# EAGLE schematic Circuit V1 (EAGLE 9.2.0)
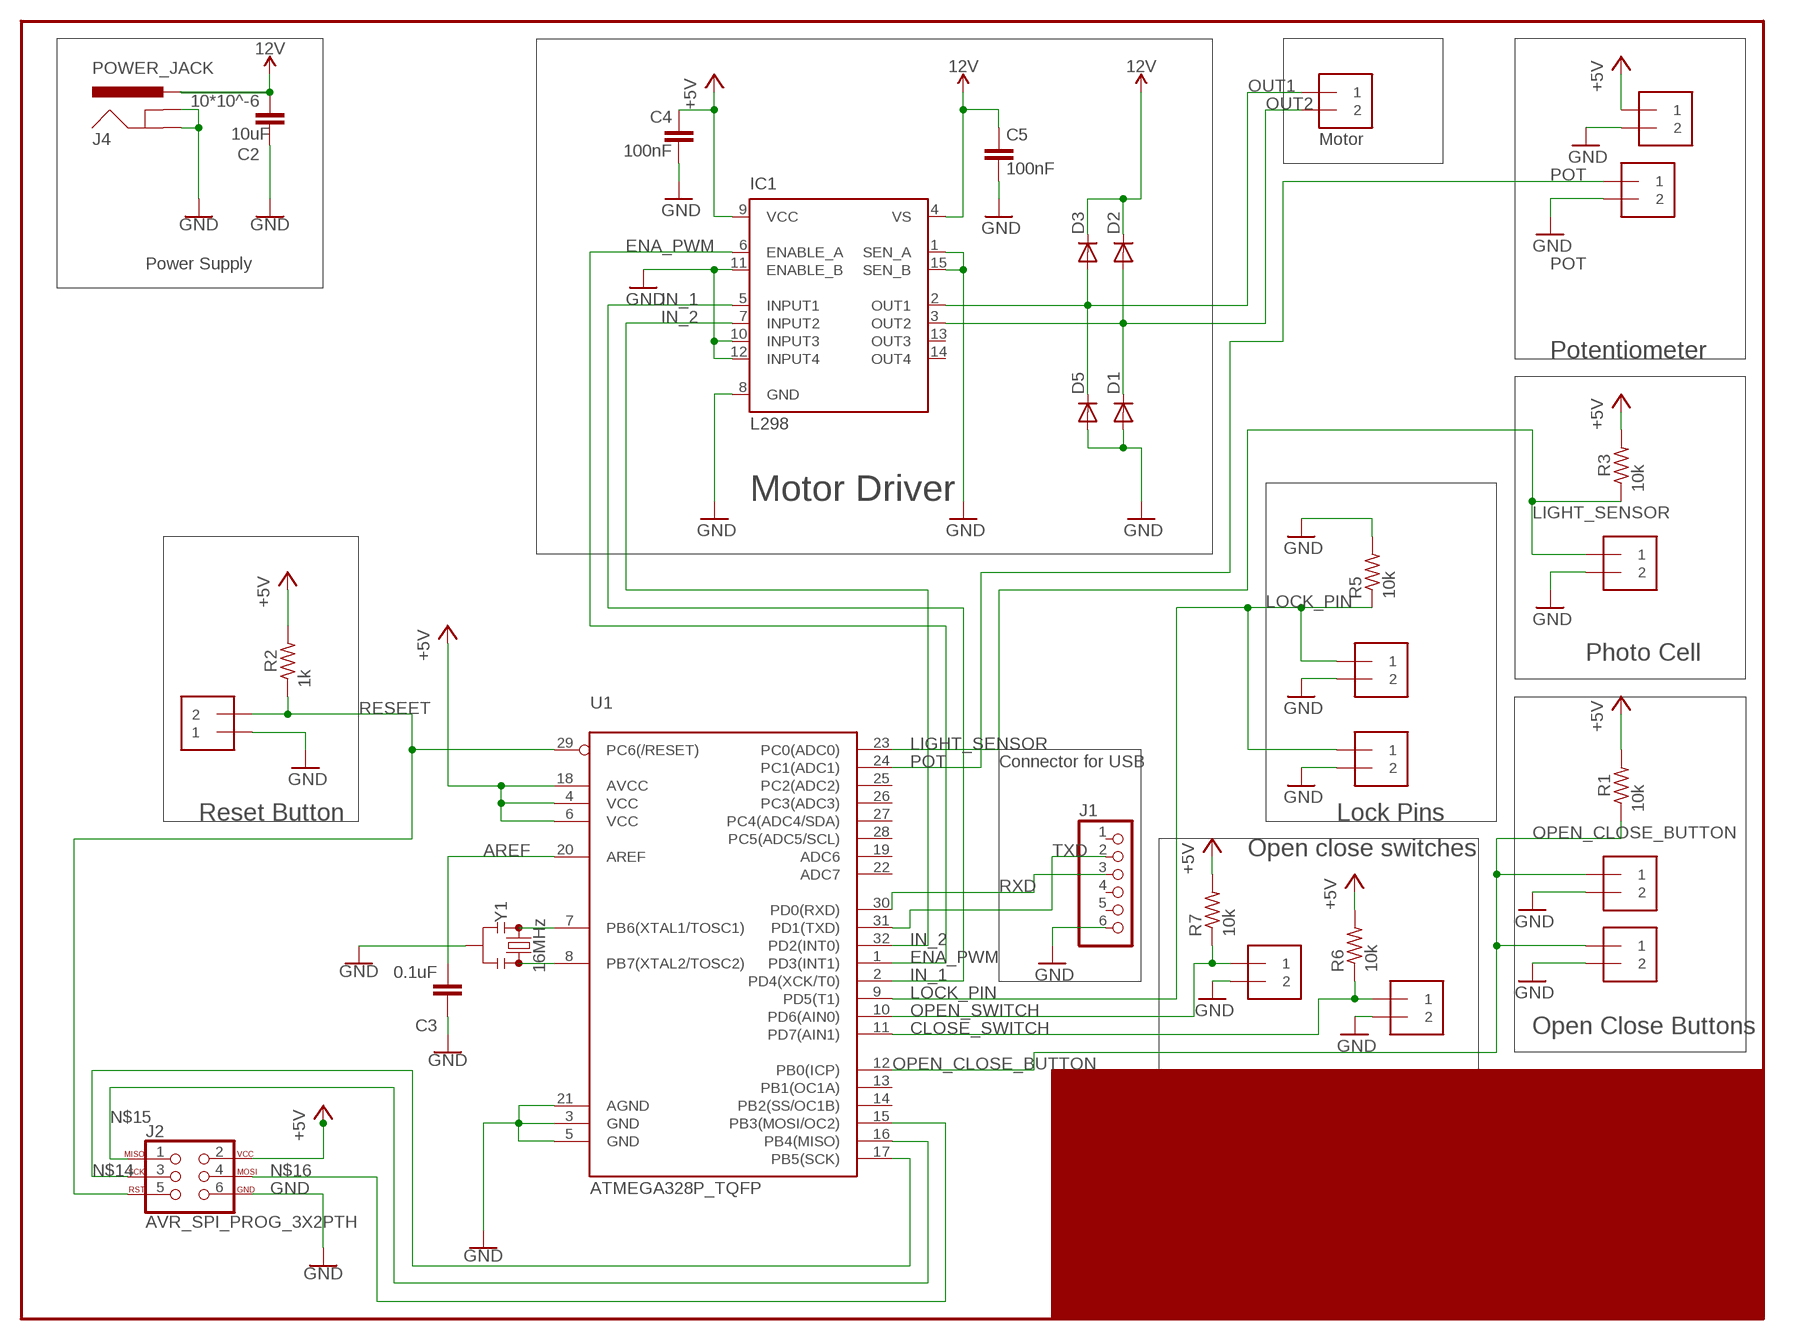
[diagram p0: schematic, sheet 1]

## Parts
C2  10*10^-6  C-EUC0805  [C0805]
C3  0.1uF  C-EUC0805  [C0805]
C4  100nF  C-EUC0805  [C0805]
C5  100nF  C-EUC0805  [C0805]
D1  DIODE-DO214AA  [DO214AA]
D2  DIODE-DO214AA  [DO214AA]
D3  DIODE-DO214AA  [DO214AA]
D5  DIODE-DO214AA  [DO214AA]
FRAME1  FRAME-LETTER  [CREATIVE_COMMONS]
IC1  L298  [MULTIWATT-15]
INSIDE_BUTTON  1X2-3.5MM  [1X2-3.5MM]
INSIDE_OPEN_BUTTON  1X2-3.5MM  [1X2-3.5MM]
J1  PINHD-1X6  [1X06]
J2  AVR_SPI_PROG_3X2PTH  [2X3]
J4  POWER_JACK  [POWER_JACK_PTH]
LIGHT_SENSOR  1X2-3.5MM  [1X2-3.5MM]
LOCK_PIN1  1X2-3.5MM  [1X2-3.5MM]
LOCK_PIN2  1X2-3.5MM  [1X2-3.5MM]
MOTOR  1X2-3.5MM  [1X2-3.5MM]
OUTSIDE_BUTTON  1X2-3.5MM  [1X2-3.5MM]
OUTSIDE_OPEN_BUTTON  1X2-3.5MM  [1X2-3.5MM]
POT  1X2-3.5MM  [1X2-3.5MM]
POTPOWER  1X2-3.5MM  [1X2-3.5MM]
R1  10k  R-US_M0805  [M0805]
R2  1k  R-US_M0805  [M0805]
R3  10k  R-US_M0805  [M0805]
R5  10k  R-US_M0805  [M0805]
R6  10k  R-US_M0805  [M0805]
R7  10k  R-US_M0805  [M0805]
RESETBUTTON  1X2-3.5MM  [1X2-3.5MM]
U1  ATMEGA328P_TQFP  [TQFP32-08]
Y1  16MHz  RESONATOR-16MHZSMD_3.2X1.3  [RESONATOR-SMD-3.2X1.3]

## Nets
12V [Power]: C2.2 C5.1 D2.C D3.C IC1.4(VS) J4.PWR
+5V: C4.1 IC1.9(VCC) J2.2 POTPOWER.1 R1.2 R2.2 R3.2 R6.2 R7.2 U1.4(VCC) U1.6(VCC) U1.18(AVCC)
AREF: C3.2 U1.20(AREF)
CLOSE_SWITCH: INSIDE_OPEN_BUTTON.1 R6.1 U1.11(PD7(AIN1))
ENA_PWM: IC1.6(ENABLE_A) U1.1(PD3(INT1))
GND [gnd]: C2.1 C3.1 C4.2 C5.2 D1.A D5.A IC1.1(SEN_A) IC1.8(GND) IC1.10(INPUT3) IC1.11(ENABLE_B) IC1.12(INPUT4) IC1.15(SEN_B) INSIDE_BUTTON.2 INSIDE_OPEN_BUTTON.2 J1.6 J2.6 J4.GND J4.GNDBREAK LIGHT_SENSOR.2 LOCK_PIN1.2 LOCK_PIN2.2 OUTSIDE_BUTTON.2 OUTSIDE_OPEN_BUTTON.2 POT.2 POTPOWER.2 R5.2 RESETBUTTON.1 U1.3(GND) U1.5(GND) U1.21(AGND) Y1.2
IN_1: IC1.5(INPUT1) U1.2(PD4(XCK/T0))
IN_2: IC1.7(INPUT2) U1.32(PD2(INT0))
LIGHT_SENSOR: LIGHT_SENSOR.1 R3.1 U1.23(PC0(ADC0))
LOCK_PIN: LOCK_PIN1.1 LOCK_PIN2.1 R5.1 U1.9(PD5(T1))
N$14: J2.3 U1.17(PB5(SCK))
N$15: J2.1 U1.16(PB4(MISO))
N$16: J2.4 U1.15(PB3(MOSI/OC2))
N$19: U1.7(PB6(XTAL1/TOSC1)) Y1.1
N$20: U1.8(PB7(XTAL2/TOSC2)) Y1.3
OPEN_CLOSE_BUTTON: INSIDE_BUTTON.1 OUTSIDE_BUTTON.1 R1.1 U1.12(PB0(ICP))
OPEN_SWITCH: OUTSIDE_OPEN_BUTTON.1 R7.1 U1.10(PD6(AIN0))
OUT1 [Motor line]: D3.A D5.C IC1.2(OUT1) MOTOR.1
OUT2 [Motor line]: D1.C D2.A IC1.3(OUT2) MOTOR.2
POT: POT.1 U1.24(PC1(ADC1))
RESEET: J2.5 R2.1 RESETBUTTON.2 U1.29(PC6(/RESET))
RXD: J1.3 U1.30(PD0(RXD))
TXD: J1.2 U1.31(PD1(TXD))
Unconnected: IC1.13(OUT3) IC1.14(OUT4) J1.1 J1.4 J1.5 U1.13(PB1(OC1A)) U1.14(PB2(SS/OC1B)) U1.19(ADC6) U1.22(ADC7) U1.25(PC2(ADC2)) U1.26(PC3(ADC3)) U1.27(PC4(ADC4/SDA)) U1.28(PC5(ADC5/SCL))

## Notes on the sheet
- Motor
- Power Supply
- Potentiometer
- Motor Driver
- Photo Cell
- Connector for USB
- Reset Button | Lock Pins
- Open close switches
- Open Close Buttons
- Group 5
- Light Controlled Chicken door opener

## Library data of the parts
C2 = rcl:C-EU: CAPACITOR, European symbol; SPICEPREFIX: 10uF
C3-C5 = rcl:C-EU: CAPACITOR, European symbol; SPICEPREFIX: C
D1-D3 D5 = diode:DIODE-: DIODE
FRAME1 = SparkFun-Aesthetics:FRAME-LETTER: Schematic Frame - Letter Standard 8.5x11 US Letter frame
IC1 = st-microelectronics:L298: DUAL FULL-BRIDGE DRIVER; MPN: L298N; OC_FARNELL: 1589425; OC_NEWARK: 32M1527
INSIDE_BUTTON INSIDE_OPEN_BUTTON LIGHT_SENSOR LOCK_PIN1 LOCK_PIN2 MOTOR OUTSIDE_BUTTON OUTSIDE_OPEN_BUTTON POT POTPOWER RESETBUTTON = adafruit:1X2: 3.5mm Terminal block http://www.ladyada.net/library/pcb/eaglelibrary.html
J1 = pinhead:PINHD-1X6: PIN HEADER
J2 = SparkFun-Connectors:AVR_SPI_PROG_3X2: AVR ISP 6 Pin This is the reduced ISP connector for AVR programming. Common on Arduino. This footprint will take up less PCB space and can be used with a 10-pin to 6-pin adapter such as SKU: BOB-08508 **Special note about "TEST_POINT" package. The stop mask is on the top side, so if you want your programming test points to be on the bottom of your board, make sure to place this package on the bottom side of the board. This also ensure that the orientation to program from the bottom side will be correct. SparkFun Products: SparkFun ISP Pogo Adapter <https://www.sparkfun.com/products/11591> - NS Tiny AVR Programmer <https://www.sparkfun.com/products/11801> -PTH
J4 = SparkFun-Connectors:POWER_JACK: Power Jack Connector This is the standard 5.5mm barrel jack for power. The PTH is the most common, proven, reliable, footprint. The Slot footprint only works if the mill layer is transmitted to the PCB fab house so be warned. Here are the connectors we sell at SparkFun: DC Barrel Power Jack/Connector <https://www.sparkfun.com/products/119> (PRT-00119) DC Barrel Power Jack/Connector (SMD) <https://www.sparkfun.com/products/12748> (PRT-12748) DC Barrel Jack Adapter - Breadboard Compatible <https://www.sparkfun.com/products/10811> (PRT-10811) It is used on this SparkFun product (and many, many others): SparkFun RedBoard - Programmed with Arduino <https://www.sparkfun.com/products/12757> (DEV-12757) Also, if you need a mating power supply or connector, please check these out: Wall Adapter Power Supply - 9VDC 650mA <https://www.sparkfun.com/products/298> (TOL-00298) DC Barrel Jack Adapter - Male <https://www.sparkfun.com/products/10287> (PRT-10287); PROD_ID: CONN-08197
R1-R3 R5-R7 = rcl:R-US_: RESISTOR, American symbol; SPICEPREFIX: R
U1 = SparkFun-IC-Microcontroller:ATMEGA328P_TQFP: Popular 328P in QFP Storefront component: ATmega328 - TQFP <https://www.sparkfun.com/products/13448> (COM-13448) Datasheet <http://www.sparkfun.com/datasheets/Components/SMD/ATMega328.pdf> SparkFun Products SparkFun RedBoard - Programmed with Arduino <https://www.sparkfun.com/products/12757> (DEV-12757) Arduino Pro Mini 328 - 5V/16MHz <https://www.sparkfun.com/products/11113> (DEV-11113) Arduino Pro Mini 328 - 3.3V/8MHz <https://www.sparkfun.com/products/11114> (DEV-11114) SparkFun OpenLog <https://www.sparkfun.com/products/13712> (DEV-13712) SparkFun MicroView - OLED Arduino Module <https://www.sparkfun.com/products/12923> (DEV-12923) SparkFun Digital Sandbox <https://www.sparkfun.com/products/12651> (DEV-12651) SparkFun PicoBoard <https://www.sparkfun.com/products/11888> (WIG-11888) Arduino Fio <https://www.sparkfun.com/products/10116> (DEV-10116) LilyPad Arduino 328 Main Board <https://www.sparkfun.com/products/13342> (DEV-13342) SparkFun RedStick <https://www.sparkfun.com/products/13741> (DEV-13741) LilyPad MP3 <https://www.sparkfun.com/products/11013> (DEV-11013) LilyPad Arduino SimpleSnap <https://www.sparkfun.com/products/10941> (DEV-10941) SparkFun Stepoko <https://www.sparkfun.com/products/13899> (ROB-13899) SparkFun Geiger Counter <https://www.sparkfun.com/products/11345> (SEN-11345) SparkFun EL Sequencer <https://www.sparkfun.com/products/12781> (COM-12781) Arduino Pro 328 - 5V/16MHz <https://www.sparkfun.com/products/10915> (DEV-10915) CryptoCape <https://www.sparkfun.com/products/12773> (DEV-12773) SparkFun IR Thermometer Evaluation Board - MLX90614 <https://www.sparkfun.com/products/10740> (SEN-10740) SparkFun RedBot Mainboard <https://www.sparkfun.com/products/12097> (ROB-12097) Arduino Pro 328 - 3.3V/8MHz <https://www.sparkfun.com/products/10914> (DEV-10914) SparkFun Block for Intel® Edison - Arduino <https://www.sparkfun.com/products/13036> (DEV-13036) SparkFun Simon Says - Surface Mount Soldering Kit <https://www.sparkfun.com/products/10935> (KIT-10935) SparkFun 7-Segment Serial Display - Red <https://www.sparkfun.com/products/11441> (COM-11441) SparkFun 7-Segment Serial Display - White <https://www.sparkfun.com/products/11629> (COM-11629) SparkFun 7-Segment Serial Display - Yellow <https://www.sparkfun.com/products/11443> (COM-11443) SparkFun 7-Segment Serial Display - Kelly Green <https://www.sparkfun.com/products/11440> (COM-11440) SparkFun 7-Segment Serial Display - Blue <https://www.sparkfun.com/products/11442> (COM-11442) SparkFun OpenSegment Serial Display - 20mm (Blue) <https://www.sparkfun.com/products/11647> (COM-11647) SparkFun OpenSegment Serial Display - 20mm (Green) <https://www.sparkfun.com/products/11646> (COM-11646) SparkFun OpenSegment Serial Display - 20mm (White) <https://www.sparkfun.com/products/11648> (COM-11648) SparkFun OpenSegment Serial Display - 20mm (Red) <https://www.sparkfun.com/products/11644> (COM-11644) SparkFun OpenSegment Serial Display - 20mm (Yellow) <https://www.sparkfun.com/products/11645> (COM-11645) SparkFun OpenSegment Shield <https://www.sparkfun.com/products/13190> (DEV-13190); PROD_ID: IC-09069
Y1 = SparkFun-Clocks:RESONATOR-16MHZ: 16MHz Resonator Digikey Example <http://www.digikey.com/product-detail/en/murata-electronics-north-america/CSTCE16M0V53-R0/490-1198-1-ND/584635> Frequency: 16MHz Frequency Stability: ±0.3% Frequency Tolerance: ±0.5% Capacitance: 15pF SparkFun Products SparkFun OpenLog <https://www.sparkfun.com/products/13712> SparkFun MicroView - OLED Arduino Module <https://www.sparkfun.com/products/12923>; PROD_ID: XTAL-08900

## Net classes
0 default: width 0.1 mm, drill 0.8 mm, clearance 0.2 mm
1 Power: width 2.54 mm, drill 0.8 mm, clearance 0.2 mm
2 gnd: width 0.03 mm, drill 0.559 mm, clearance 0.254 mm
3 Motor line: width 0.12 mm, drill 0.8 mm, clearance 0.2 mm